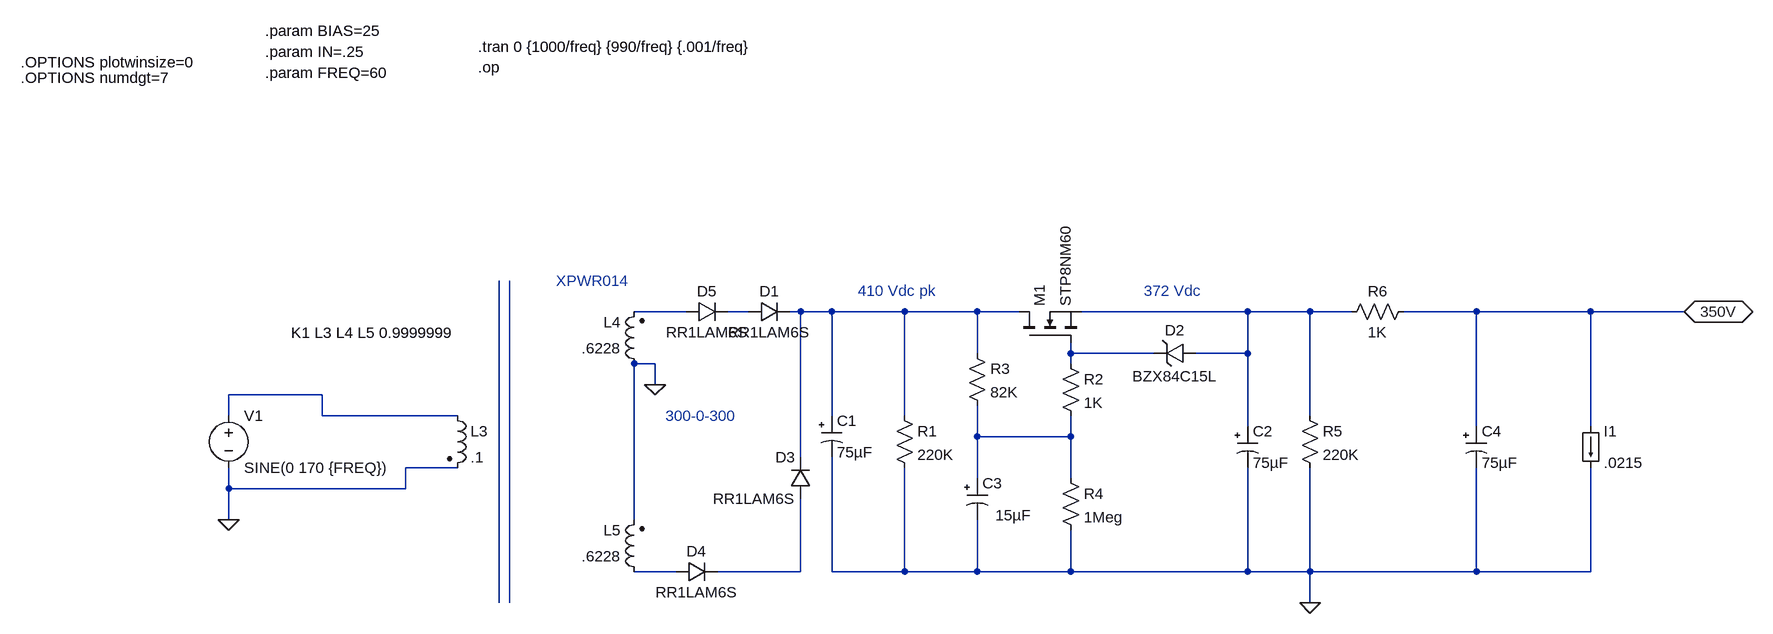
[diagram p0: schematic Preamp PSU power test SIM.asc]
Preamp PSU power test SIM.asc, the LTspice schematic file:
Version 4
SHEET 1 1720 680
WIRE 64 -112 -16 -112
WIRE 160 -112 128 -112
WIRE 240 -112 224 -112
WIRE 288 -112 240 -112
WIRE 400 -112 288 -112
WIRE 512 -112 400 -112
WIRE 576 -112 512 -112
WIRE 928 -112 672 -112
WIRE 1024 -112 928 -112
WIRE 1088 -112 1024 -112
WIRE 1280 -112 1168 -112
WIRE 1456 -112 1280 -112
WIRE 1600 -112 1456 -112
WIRE 512 -48 512 -112
WIRE 656 -48 656 -64
WIRE 784 -48 656 -48
WIRE 928 -48 928 -112
WIRE 928 -48 848 -48
WIRE 16 -32 -16 -32
WIRE 656 -32 656 -48
WIRE 16 0 16 -32
WIRE -496 16 -640 16
WIRE -640 48 -640 16
WIRE -496 48 -496 16
WIRE -288 48 -496 48
WIRE 288 48 288 -112
WIRE 400 48 400 -112
WIRE 1024 48 1024 -112
WIRE 928 64 928 -48
WIRE 1280 64 1280 -112
WIRE 1456 64 1456 -112
WIRE 512 80 512 32
WIRE 656 80 656 48
WIRE 656 80 512 80
WIRE 240 112 240 -112
WIRE -288 128 -368 128
WIRE 512 144 512 80
WIRE 656 144 656 80
WIRE -640 160 -640 128
WIRE -368 160 -368 128
WIRE -368 160 -640 160
WIRE -640 208 -640 160
WIRE -16 208 -16 -32
WIRE 48 288 -16 288
WIRE 240 288 240 176
WIRE 240 288 112 288
WIRE 288 288 288 112
WIRE 400 288 400 128
WIRE 400 288 288 288
WIRE 512 288 512 208
WIRE 512 288 400 288
WIRE 656 288 656 224
WIRE 656 288 512 288
WIRE 928 288 928 128
WIRE 928 288 656 288
WIRE 1024 288 1024 128
WIRE 1024 288 928 288
WIRE 1280 288 1280 128
WIRE 1280 288 1024 288
WIRE 1456 288 1456 128
WIRE 1456 288 1280 288
WIRE -224 336 -224 -160
WIRE -208 336 -208 -160
WIRE 1024 336 1024 288
FLAG -640 208 0
FLAG 1600 -112 350V
IOPIN 1600 -112 BiDir
FLAG 1024 336 0
FLAG 16 0 0
SYMBOL ind2 -304 32 R0
SYMATTR InstName L3
SYMATTR Value .1
SYMATTR SpiceLine Rser=4
SYMBOL voltage -640 32 R0
WINDOW 123 0 0 Left 0
WINDOW 39 0 0 Left 0
SYMATTR InstName V1
SYMATTR Value SINE(0 170 {FREQ})
SYMBOL diode 160 -96 R270
WINDOW 0 32 32 VTop 2
WINDOW 3 0 32 VBottom 2
SYMATTR InstName D1
SYMATTR Value RR1LAM6S
SYMBOL polcap 272 48 R0
SYMATTR InstName C1
SYMATTR Value 75µF
SYMATTR SpiceLine V=450
SYMBOL res 384 32 R0
SYMATTR InstName R1
SYMATTR Value 220K
SYMBOL polcap 912 64 R0
SYMATTR InstName C2
SYMATTR Value 75µF
SYMATTR SpiceLine V=450
SYMBOL nmos 576 -64 R270
SYMATTR InstName M1
SYMATTR Value STP8NM60
SYMBOL res 640 -48 R0
SYMATTR InstName R2
SYMATTR Value 1K
SYMBOL res 496 -64 R0
SYMATTR InstName R3
SYMATTR Value 82K
SYMBOL res 640 128 R0
SYMATTR InstName R4
SYMATTR Value 1Meg
SYMBOL zener 848 -64 R90
WINDOW 0 -4 32 VBottom 2
WINDOW 3 36 32 VTop 2
SYMATTR InstName D2
SYMATTR Value BZX84C15L
SYMBOL polcap 496 144 R0
WINDOW 3 44 57 Left 2
SYMATTR Value 15µF
SYMATTR InstName C3
SYMBOL res 1008 32 R0
SYMATTR InstName R5
SYMATTR Value 220K
SYMBOL ind2 0 -16 R180
WINDOW 0 36 80 Left 2
WINDOW 3 36 40 Left 2
SYMATTR InstName L4
SYMATTR Value .6228
SYMATTR SpiceLine Rser=20
SYMBOL ind2 0 304 R180
WINDOW 0 36 80 Left 2
WINDOW 3 36 40 Left 2
SYMATTR InstName L5
SYMATTR Value .6228
SYMATTR SpiceLine Rser=20
SYMBOL diode 48 304 R270
WINDOW 0 32 32 VTop 2
WINDOW 3 0 32 VBottom 2
SYMATTR InstName D4
SYMATTR Value RR1LAM6S
SYMBOL diode 256 176 R180
WINDOW 0 24 64 Left 2
WINDOW 3 24 0 Left 2
SYMATTR InstName D3
SYMATTR Value RR1LAM6S
SYMBOL diode 64 -96 R270
WINDOW 0 32 32 VTop 2
WINDOW 3 0 32 VBottom 2
SYMATTR InstName D5
SYMATTR Value RR1LAM6S
SYMBOL load 1440 64 R0
WINDOW 123 0 0 Left 0
WINDOW 39 0 0 Left 0
SYMATTR InstName I1
SYMATTR Value .0215
SYMBOL res 1184 -128 R90
WINDOW 0 0 56 VBottom 2
WINDOW 3 32 56 VTop 2
SYMATTR InstName R6
SYMATTR Value 1K
SYMBOL polcap 1264 64 R0
SYMATTR InstName C4
SYMATTR Value 75µF
SYMATTR SpiceLine V=450
TEXT -544 -80 Left 2 !K1 L3 L4 L5 0.9999999
TEXT -960 -496 Left 2 !.OPTIONS plotwinsize=0
TEXT -960 -472 Left 2 !.OPTIONS numdgt=7
TEXT -584 -480 Left 2 !.param FREQ=60
TEXT -584 -512 Left 2 !.param IN=.25
TEXT -256 -520 Left 2 !.tran 0 {1000/freq} {990/freq} {.001/freq}
TEXT -256 -488 Left 2 !.op
TEXT -584 -544 Left 2 !.param BIAS=25
TEXT -136 -160 Left 2 ;XPWR014
TEXT 32 48 Left 2 ;300-0-300
TEXT 328 -144 Left 2 ;410 Vdc pk
TEXT 768 -144 Left 2 ;372 Vdc

The netlist it stands for:
* Preamp PSU power test SIM.asc
L3 N006 0 .1 Rser=4
V1 N006 0 SINE(0 170 {FREQ})
D1 N002 N003 RR1LAM6S
C1 N003 0 75µF V=450
R1 N003 0 220K
C2 N004 0 75µF V=450
M1 N003 N005 N004 N004 STP8NM60
R2 N005 N007 1K
R3 N003 N007 82K
R4 N007 0 1Meg
D2 N004 N005 BZX84C15L
C3 N007 0 15µF
R5 N004 0 220K
L4 0 N001 .6228 Rser=20
L5 N008 0 .6228 Rser=20
D4 N008 N009 RR1LAM6S
D3 N009 N003 RR1LAM6S
D5 N001 N002 RR1LAM6S
I1 350V 0 .0215
R6 350V N004 1K
C4 350V 0 75µF V=450
.model D D
.lib standard.dio
.model NMOS NMOS
.model PMOS PMOS
.lib standard.mos
K1 L3 L4 L5 0.9999999
.OPTIONS plotwinsize=0
.OPTIONS numdgt=7
.param FREQ=60
.param IN=.25
.tran 0 {1000/freq} {990/freq} {.001/freq}
.op
.param BIAS=25
* XPWR014
* 300-0-300
* 410 Vdc pk
* 372 Vdc
.backanno
.end